# Altium schematic sheet MCU.SchDoc
size 420 x 297 mm; SheetNumber: 3; SheetTotal: 5
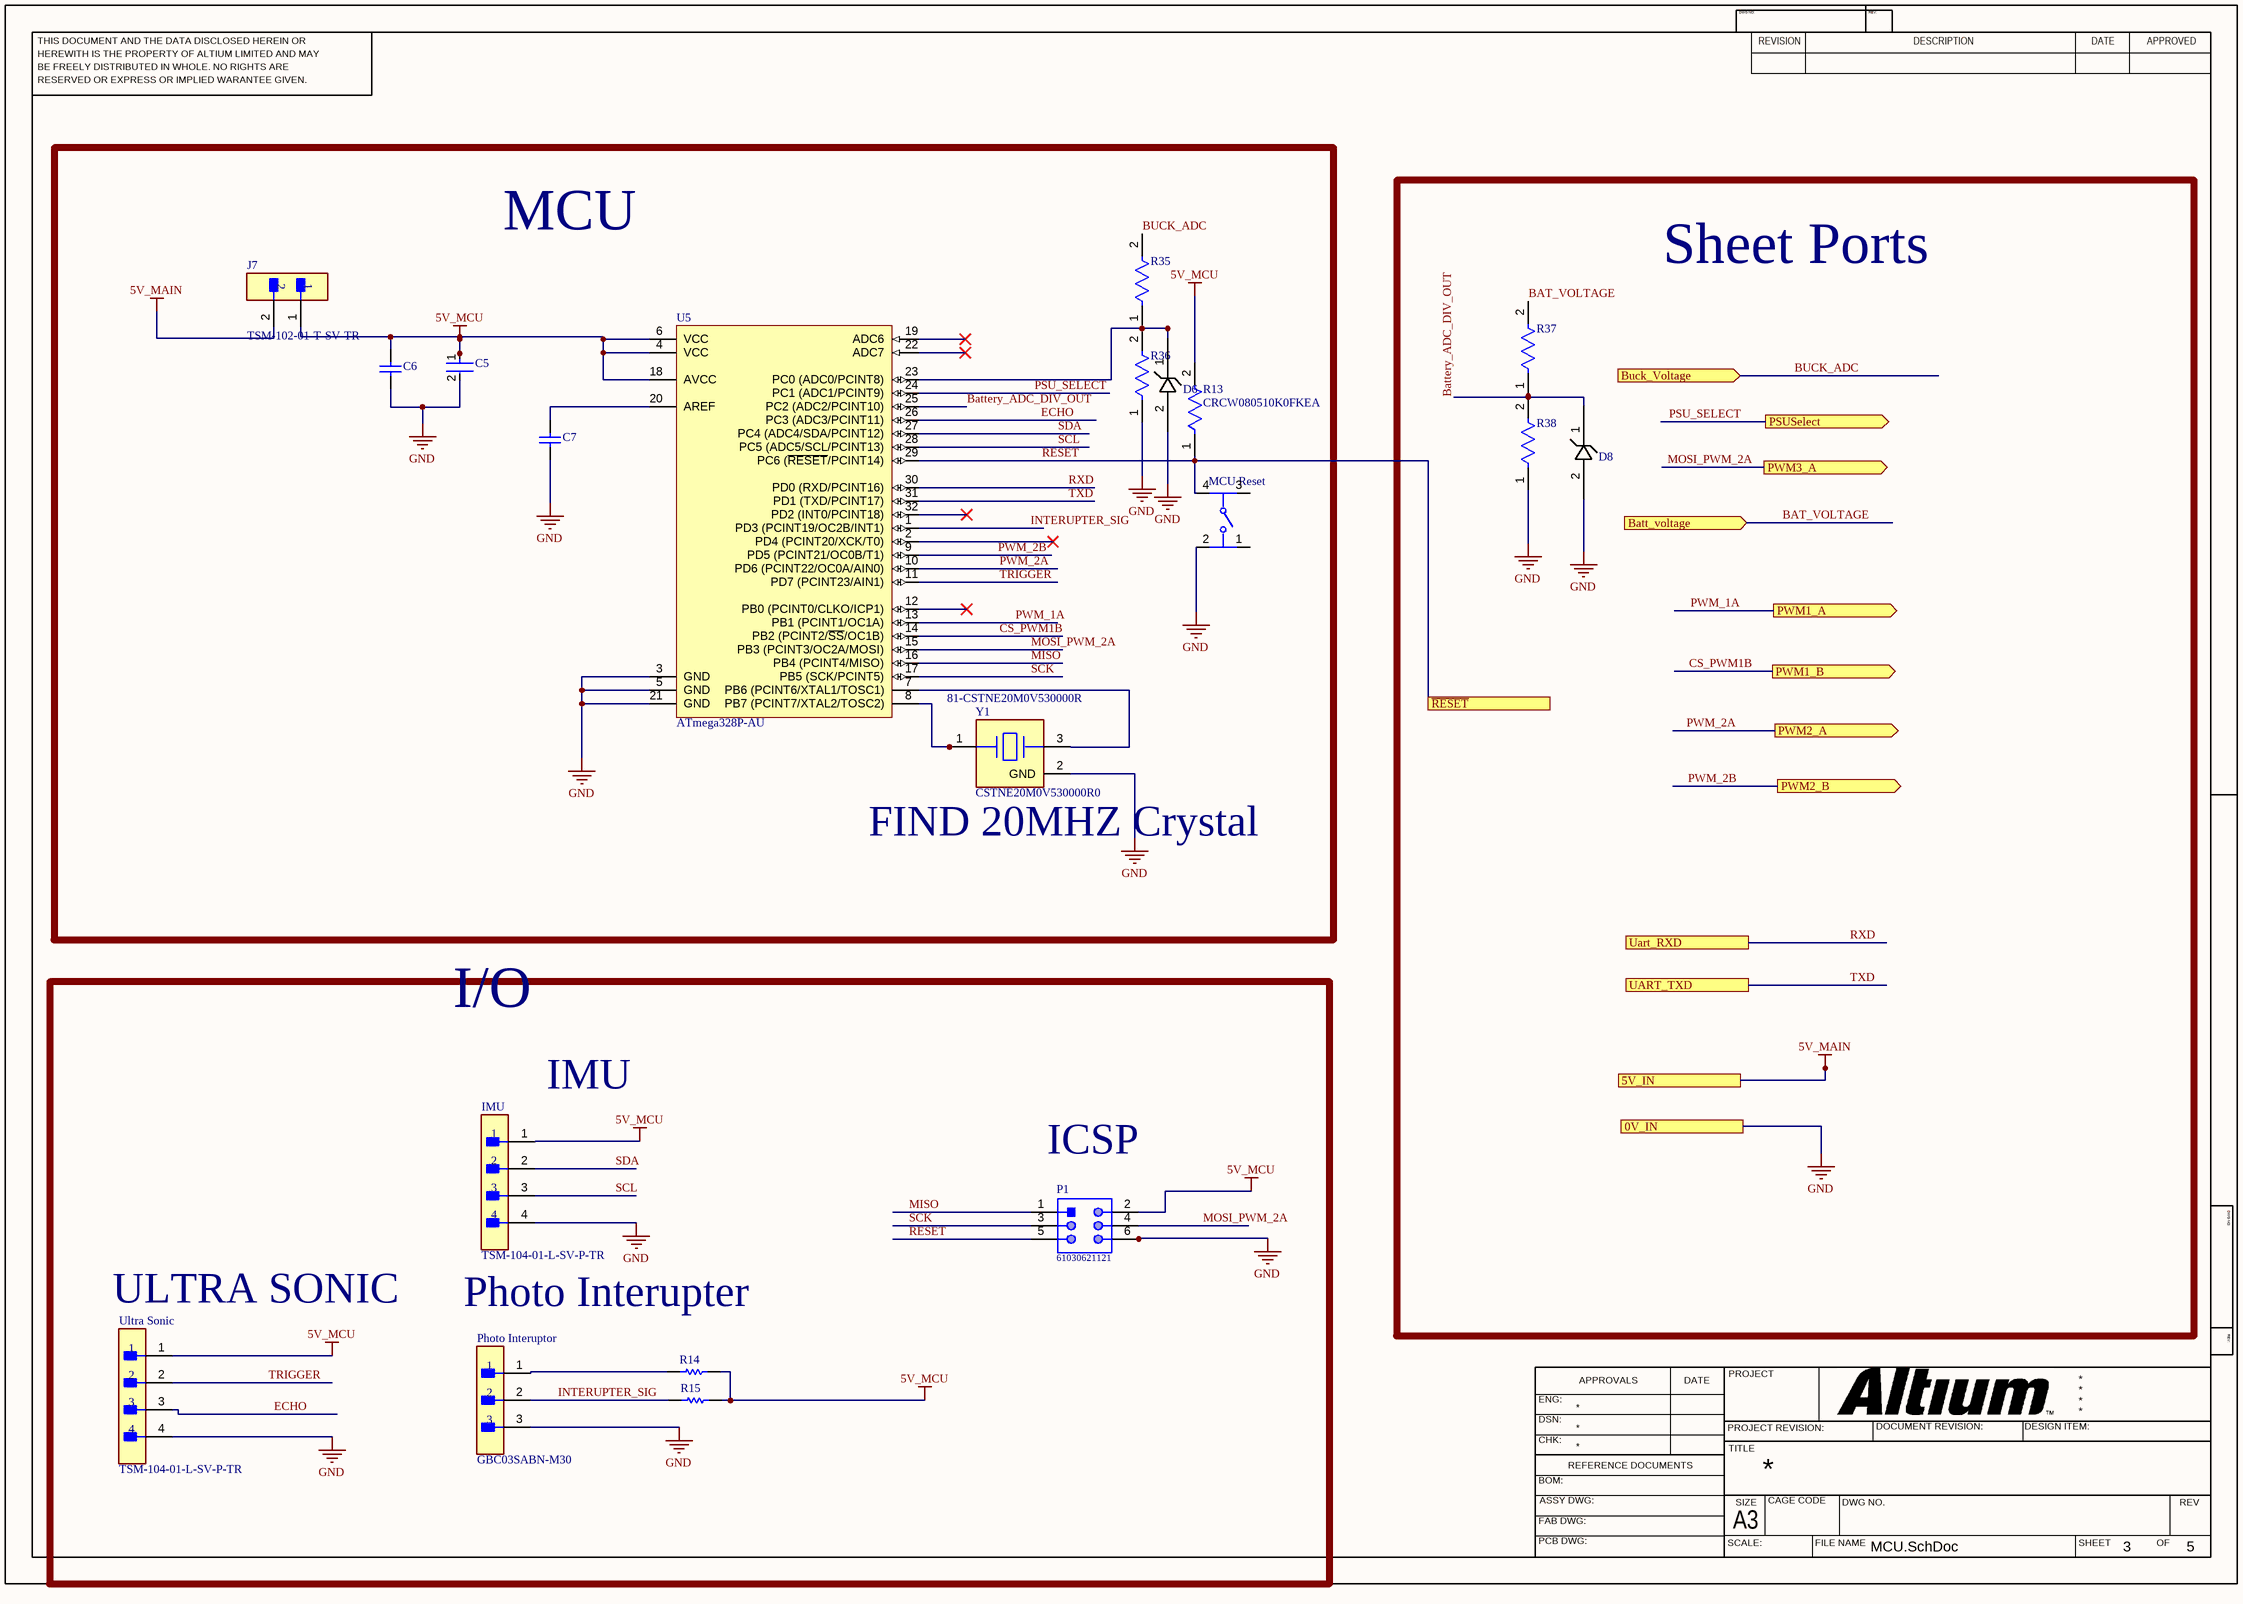
[diagram p0: MCU.SchDoc]

## Parts
C5  C0805C106K8PACTU  [FP-C0805C-DG-MFG]  (value not drawn)
C6  GRM21BR71H104KA01L  [CAPC2013X135X45ML10T25]  (value not drawn)
C7  GRM21BR71H104KA01L  [CAPC2013X135X45ML10T25]  (value not drawn)
D6  BZT52-C5V1_R1_00001  [BZT52-C5V1_R1_00001]  (value not drawn)
D8  BZT52-C5V1_R1_00001  [BZT52-C5V1_R1_00001]  (value not drawn)
IMU  TSM-104-01-L-SV-P-TR  [FP-TSM-104-01-L-SV-P-TR-MFG]
J7  TSM-102-01-T-SV-TR  [FP-TSM-102-01-T-SV-TR-MFG]
MCU_Reset  PTS645SM43SMTR92LFS  [FP-PTS645SM43SMTR92LFS-MFG]  (value not drawn)
P1  61030621121  [61030621121]
Photo_Interuptor  GBC03SABN-M30  [FP-GBC03SABN-M30-MFG]
R13  CRCW080510K0FKEA  [FP-CRCW0805-e3-MFG]
R14  ERA6AEB181V  [RESC2013X60X40LL20T25]  (value not drawn)
R15  SG73S2ATTD2201F  [RESC2013X60X30ML20T20]  (value not drawn)
R35  CRCW080510K0FKEA  [FP-CRCW0805-e3-IPC_A]  (value not drawn)
R36  CRCW080510K0FKEA  [FP-CRCW0805-e3-IPC_A]  (value not drawn)
R37  CRCW080510K0FKEA  [FP-CRCW0805-e3-IPC_A]  (value not drawn)
R38  CRCW080510K0FKEA  [FP-CRCW0805-e3-IPC_A]  (value not drawn)
U5  ATmega328P-AU  [32A_M]
Ultra_Sonic  TSM-104-01-L-SV-P-TR  [FP-TSM-104-01-L-SV-P-TR-MFG]
Y1  CSTNE20M0V530000R0  Supplier Part Number 1: 81-CSTNE20M0V530000R  [FP-CSTNE16M0V530000R0-MFG]

## Blocks framed on the sheet
MCU: C5-C7 D6 J7 MCU_Reset R13 R35 R36 U5 Y1
Sheet Ports: D8 R37 R38
I/O: IMU P1 Photo_Interuptor R14 R15 Ultra_Sonic

## Ports
0V_IN, 5V_IN, Batt_voltage (in), Buck_Voltage (in), PSUSelect (out), PWM1_A (out), PWM1_B (out), PWM2_A (out), PWM2_B (out), PWM3_A (out), Uart_RXD, UART_TXD, ~{RESET}

## Nets
5V_MAIN: J7.2 ; port 5V_IN
5V_MCU: C5.1 C6.1 IMU.1 J7.1 P1.2 R13.2 R14.2 R15.2 U5.4(VCC) U5.6(VCC) U5.18(AVCC) Ultra_Sonic.1
GND: C5.2 C6.2 C7.2 D6.2 D8.2 IMU.4 MCU_Reset.2 P1.6 Photo_Interuptor.3 R36.1 R38.1 U5.3(GND) U5.5(GND) U5.21(GND) Ultra_Sonic.4 Y1.2(GND) ; port 0V_IN
BAT_VOLTAGE: R37.2 ; port Batt_voltage
Battery_ADC_DIV_OUT: D8.1 R37.1 R38.2 U5.25(PC2_(ADC2/PCINT10))
BUCK_ADC: R35.2 ; port Buck_Voltage
CS_PWM1B: U5.14(PB2_(PCINT2/~{SS}/OC1B)) ; port PWM1_B
ECHO: U5.26(PC3_(ADC3/PCINT11)) Ultra_Sonic.3
INTERUPTER_SIG: Photo_Interuptor.2 R15.1 U5.1(PD3_(PCINT19/OC2B/INT1))
MISO: P1.1 U5.16(PB4_(PCINT4/MISO))
MOSI_PWM_2A: P1.4 U5.15(PB3_(PCINT3/OC2A/MOSI)) ; port PWM3_A
PSU_SELECT: U5.24(PC1_(ADC1/PCINT9)) ; port PSUSelect
PWM_1A: U5.13(PB1_(PCINT1/OC1A)) ; port PWM1_A
PWM_2A: U5.10(PD6_(PCINT22/OC0A/AIN0)) ; port PWM2_A
PWM_2B: U5.9(PD5_(PCINT21/OC0B/T1)) ; port PWM2_B
RESET: MCU_Reset.4 P1.5 R13.1 U5.29(PC6_(~{RESET}/PCINT14)) ; port ~{RESET}
RXD: U5.30(PD0_(RXD/PCINT16)) ; port Uart_RXD
SCK: P1.3 U5.17(PB5_(SCK/PCINT5))
SCL: IMU.3 U5.28(PC5_(ADC5/SCL/PCINT13))
SDA: IMU.2 U5.27(PC4_(ADC4/SDA/PCINT12))
TRIGGER: U5.11(PD7_(PCINT23/AIN1)) Ultra_Sonic.2
TXD: U5.31(PD1_(TXD/PCINT17)) ; port UART_TXD
NetC7_1: C7.1 U5.20(AREF)
NetD6_1: D6.1 R35.1 R36.2 U5.23(PC0_(ADC0/PCINT8))
NetPhoto_Interuptor_1: Photo_Interuptor.1 R14.1
NetU5_7: U5.7(PB6_(PCINT6/XTAL1/TOSC1)) Y1.3(Output)
NetU5_8: U5.8(PB7_(PCINT7/XTAL2/TOSC2)) Y1.1(Input)

Not connected (* = marked no-connect by the designer): MCU_Reset 1 3; U5 2(PD4_(PCINT20/XCK/T0))* 12(PB0_(PCINT0/CLKO/ICP1))* 19(ADC6)* 22(ADC7)* 32(PD2_(INT0/PCINT18))*

## Notes on the sheet
- (near Y1) FIND 20MHZ Crystal
- IMU
- (near P1) ICSP
- (near Ultra_Sonic) ULTRA SONIC
- Photo Interupter
- THIS DOCUMENT AND THE DATA DISCLOSED HEREIN OR
- HEREWITH IS THE PROPERTY OF ALTIUM LIMITED AND MAY
- DWG NO:
- REVISION
- REV:
- DESCRIPTION
- DATE
- APPROVED
- BE FREELY DISTRIBUTED IN WHOLE. NO RIGHTS ARE
- RESERVED OR EXPRESS OR IMPLIED WARANTEE GIVEN.
- ENG:
- APPROVALS
- PROJECT
- DSN:
- CHK:
- REFERENCE DOCUMENTS
- PROJECT REVISION:
- TITLE
- DOCUMENT REVISION:
- DESIGN ITEM:
- BOM:
- FAB DWG:
- PCB DWG:
- ASSY DWG:
- SCALE:
- A3
- SIZE
- CAGE CODE
- FILE NAME
- DWG NO.
- SHEET
- OF
- REV

## Library data of the parts
C5 = CMP-2007-03243-2: CAP CER 10UF 10V X5R 0805; Manufacturer: Kemet; 3DS Part Number: 220-00001; Tolerance: 10%; Temperature Coefficient: 15%; Material: Ceramic; Device Class L2: Capacitors; Device Class L1: Passive Components; ComponentLink2URL: https://content.kemet.com/datasheets/KEM_C1006_X5R_SMD.pdf; Height: 1.4mm; Lead Free: Yes; Manufacturer Part Number: C0805C106K8PACTU; Digikey Description: CAP CER 10UF 10V X5R 0805; Octopart: https://octopart.com/c0805c106k8pactu-kemet-98697; Capacitance: 10uF; Value: 10uF; Temperature Range Low: -55°C; Temperature: -55°C to +85°C; Automotive: No; Mouser Description: CAP CER 10UF 10V X5R 0805; Ipc Land Pattern Name: CAPC200125X125; Temperature Range High: +85°C; Voltage: 10V; RoHS: TRUE; Device Class L3: Ceramic Capacitors; ComponentLink2Description: Datasheet; Voltage Rating: 10V; Package: C0805C-DG; Temperature Characteristic: X5R; Category: Cap
C6 C7 = CMP-2100-03644-1: Chip Capacitor, 0.1 uF, +/- 10%, 50 V, -55 to 125 degC, 0805 (2012 Metric), RoHS, Tape and Reel; Manufacturer: Murata; Voltage: 50V; Capacitance: 100nF; Insulation Resistance: 10GR; Dielectric Material: Ceramic; Dielectric: X7R; Package Description: 2-Pin Surface Mount Device, Body 2 x 1.25 mm; Manufacturer URL: http://www.murata.com/; Case Code (Imperial): 0805; Datasheet URL: http://psearch.en.murata.com/capacitor/product/GRM21BR71H104KA01%23.pdf; Termination: SMD/SMT; Lead Free: LeadFree; Package Quantity: 1; Mount: SurfaceMount; REACH SVHC: Unknown; Thickness: 0.053inch; Height: 1.25mm; Case/Package: 0805; Voltage Rating: 50V; Width: 0.049inch; Case Code (Metric): 2012; Material: Ceramic; Min Operating Temperature: -55degC; RoHSCompliant: true; Datasheet Version: 42675.0; Voltage Rating (DC): 50V; Tolerance: 10%; Package Reference: 0805; Depth: 1.25mm; Length: 2mm; Max Operating Temperature: 125degC; Packaging: TapeandReel; Number of Pins: 2; Radiation Hardening: No
D6 D8 = BZT52-C5V1_R1_00001: BZT52-C5V1_R1_00001 / 5.1V Zener Diode
IMU Ultra_Sonic = CMP-02766-000011-1: CONN HEADER SMD 4POS 2.54MM; Manufacturer: Samtec; Number Of Contacts: 4; Conn Gender: Male; Standoff Height: 0.04inch; Conn Orientation: Vertical; Current Rating: 5.4A; Voltage Rating: 475V; Manufacturer Part Number: TSM-104-01-L-SV-P-TR; Contact Material: Gold,Nickel; RoHS: TRUE; ComponentLink2URL: http://suddendocs.samtec.com/prints/tsm-1xx-xx-xxx-sv-xx-xxx-xx-mkt.pdf; Package: TSM-104-01-L-SV-P-TR; Lead Free: Yes; Automotive: No; Category: Conn; Digikey Description: CONN HEADER SMD 4POS 2.54MM; ComponentLink2Description: Datasheet; Temperature: -55°C to +125°C; Height: 0.403inch; Device Class L1: Connectors; Device Class L3: unset; Octopart: https://octopart.com/tsm-104-01-l-sv-p-tr-samtec-6805355; Pitch: 2.54mm; Footprint Url: http://suddendocs.samtec.com/prints/tsm-1xx-xx-xx-sv-xx-xxx-xx-footprint.pdf; Device Class L2: Headers and Wire Housings; Temperature Range Low: -55°C; Number Of Rows: 1; Temperature Range High: +125°C
J7 = CMP-02766-000113-1: CONN HEADER SMD 2POS 2.54MM; Gender: Male; Max Voltage Rating (AC): 475V; Number of Contacts: 2; Max Current Rating: 7A; Contact Material: Bronze; Min Operating Temperature: -55°C; REACH SVHC: No SVHC; Housing Material: Polymer; Lead Free: Lead Free; Orientation: Straight; Radiation Hardening: No; Number of Rows: 1; Length: 5.08mm; Housing Color: Black; Max Operating Temperature: 105°C; Contact Plating: Tin; Depth: 2.54mm; Packaging: Tape and Reel; Pitch: 2.54mm; Termination: Solder
MCU_Reset = CMP-2000-05160-2: SWITCH TACTILE SPST-NO 0.05A 12V; Contact Resistance: 100mR; Throw Configuration: SPST; Illumination Type: Non-Illuminated; Mechanical Life: 100000Cycles; Current Rating: 50mA; Switch Function: Off-Mom; Actuator Length: 0.85mm; Actuator Material: Nylon; Actuator Type: Standard; Operating Force: 160gf; Min Operating Temperature: -20°C; REACH SVHC: No SVHC; Termination: Gull Wing; Case/Package: SMD/SMT; Packaging: Tape and Reel; Mount: Surface Mount; Voltage Rating (DC): 12V; Orientation: Straight; Lead Free: Lead Free; Contact Material: Silver; Color: Black; Max Current Rating: 50mA; Contact Plating: Silver; Depth: 9mm; Package Quantity: 1; Max Voltage Rating (DC): 12V; Length: 6mm; Max Operating Temperature: 60°C
P1 = CMP-1502-01051-1: SMT Vertical Pin Header WR-PHD, Pitch 2.54 mm, Dual Row, 6 pins; Manufacturer: Wurth Elektronik; Gender: Male; Withstanding Voltage: 500VAC; Contact Resistance: 20mOhm; Pitch: 2.54mm; Working Voltage: 250VAC; Rated Current: 3A; Pin Number: 6; Part Number: 61030621121; Row Number: Dual; Operating Temperature: -40to125degC; Packaging: TapeandReel; Manufacturer URL: http://www.we-online.de; Package Reference: 61030621121; Publisher: WurthElektronik; Orientation: Vertical; Mounting Technology: SMT; Datasheet URL: https://katalog.we-online.de/em/datasheet/6103xx21121.pdf
Photo_Interuptor = CMP-25680-000055-1: CONN HEADER SMD 3POS 2.54MM; Number of Positions: 3; Gender: Male; Connector Type: Male Pin; Pitch: 0.1inch; Contact Type: Male Pin; Contact Mating Length: 0.23inch; Termination: Solder; Housing Material: Plastic; Width: 2.54mm; Package Quantity: 1; Lead Free: Lead Free; Color: Black; Contact Plating: Gold; Housing Color: Black; Mount: Surface Mount; RoHS Compliant: Yes; Length: 7.62mm; Height: 2.54mm; Number of Contacts: 3; Contact Material: Bronze; Series: -; Number of Rows: 1; Packaging: Bulk
R13 R35-R38 = CMP-2001-04908-2: RES Thick Film, 10kΩ, 1%, 0.125W, 100ppm/°C, 0805; Resistance: 10kR; Voltage Rating (DC): 150V; Power Rating: 125mW; Weight: 0.000194oz; Package Quantity: 5000; Military Standard: Not; Max Operating Temperature: 155°C; Temperature Coefficient: 100ppm/°C; Contact Plating: Tin; Width: 1.25mm; Height: 0.45mm; Radiation Hardening: No; Tolerance: 1%; Min Operating Temperature: -55°C; Voltage Rating: 150V; Length: 2mm; Depth: 1.25mm; Termination: SMD/SMT; Packaging: Tape and Reel; Case/Package: 0805; Case Code (Metric): 2012; Lead Free: Lead Free; Case Code (Imperial): 0805; Composition: Thick Film
R14 = CMP-2001-00604-1: Manufacturer: Panasonic; Part Number: ERA6AEB181V
R15 = CMP-2001-02579-1: Manufacturer: KOA Speer; Part Number: SG73S2ATTD2201F
U5 = CMP-0095-00269-2: 8-bit AVR Microcontroller, 32KB Flash, 1KB EEPROM, 2KB SRAM, 32-pin TQFP, Industrial Grade (-40°C to 85°C); PackageDescription: 32-Lead, 7x7x1.0 mm Body, 0.8mm Lead Pitch, Thin Profile Plastic Quad Flat Package (TQFP); DatasheetVersion: revD, May-2011; RevisionNote: DatasheetVersion & PackageVersion updated. URLs added.; ComponentLink1URL: http://www.atmel.com/; ComponentLink2Description: ATmega48A/48PA/88A/88PA/168A/168PA/328/328P Datasheet; Code_JEDEC: MS-026-ABA; ComponentLink1Description: Manufacturer URL; PackageReference: 32A; ComponentLink3Description: ATmega48A/48PA/88A/88PA/168A/168PA/328/328P Summary; ComponentLink2URL: http://www.atmel.com/dyn/resources/prod_documents/doc8271.pdf; PackageVersion: revC, Oct-2010; ComponentLink3URL: http://www.atmel.com/dyn/resources/prod_documents/8271S.pdf
Y1 = CMP-06054-000001-1: CERAMIC RES 20.0000MHZ 15PF SMD; Manufacturer Part Number: CSTNE16M0V530000R0; Manufacturer: Murata; Tolerance: 0.5%; Stability: 0.3%; Frequency: 16MHz; Esr: 40Ω; Isolated Power: No; Number of Channels: 6; Channel Type: Unidirectional; Data Rate: 150Mbps; Propagation Delay: 13ns; Pulse Width Distortion (PWD): 4.5ns; Impedance: 40R; Lead Free: Yes; ComponentLink2URL: https://www.murata.com/en-sg/products/productdata/8801162231838/SPEC-CSTNE16M0V530000R0.pdf?1545967809000; ComponentLink2Description: Datasheet; Device Class L3: Crystals; Load Capacitance: 15pF; Temperature: -40°C to +85°C; Temperature Range High: +85°C; Series: CSTNE_V; Mouser Description: Ceramic Resonator 16MHz ±0.5% (Tol) ±0.3% (Stability) 15pF 40Ohm 3-Pin CSMD T/R; Automotive: No; RoHS: TRUE; Device Class L2: Crystals / Oscillators; Package: 0; Category: Crys; Device Class L1: Passive Components; Height: 1mm; Temperature Range Low: -40°C; Digikey Description: CERAMIC RES 16.0000MHZ 15PF SMD; Octopart: https://octopart.com/cstne16m0v530000r0-murata-91406924; Supplier 1: Mouser; Stock 1: 22987; Pricing 1: 1=0.27000, 10=0.22300, 50=0.20100, 100=0.17800, 1000=0.14300, 10000=0.13400 (USD); Mount: Surface Mount; Case/Package: SSOP; Min Operating Temperature: -40°C; Max Operating Temperature: 85°C; Type: General Purpose; Resistor Type: Ceramic; Packaging: Rail/Tube; Frequency Stability: 0.3%; Frequency Tolerance: 0.5%; Capacitance: 15pF; RoHS Compliant: Yes; ComponentLink1URL: https://www.murata.com/en/products/productdata/8801161510942/SPEC-CSTNE20M0V530000R0.pdf?src-supplier=Digi-Key; ComponentLink1Description: https://www.murata.com/en/products/productdata/8801161510942/SPEC-CSTNE20M0V530000R0.pdf?src-supplier=Digi-Key